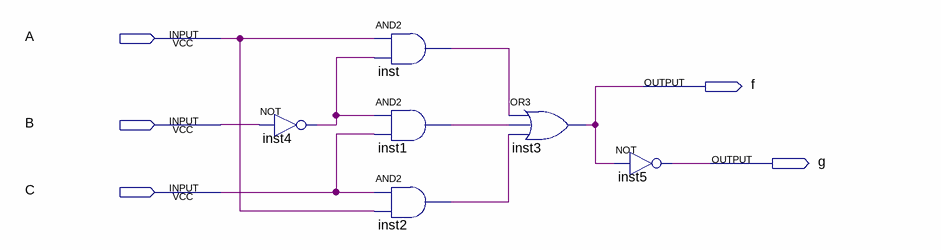
[diagram p0: schematic sheet]
// Quartus schematic pr2.bdf as structural Verilog: 6 symbols, 5 pins
module pr2 (
  input  A,
  input  B,
  input  C,
  output f,
  output g
);

  wire inst1_out, inst2_out, inst4_out, inst_out;

  not inst4 (inst4_out, B);
  and inst (inst_out, A, inst4_out);
  and inst1 (inst1_out, inst4_out, C);
  and inst2 (inst2_out, C, A);
  or inst3 (f, inst_out, inst1_out, inst2_out);
  not inst5 (g, f);
endmodule
